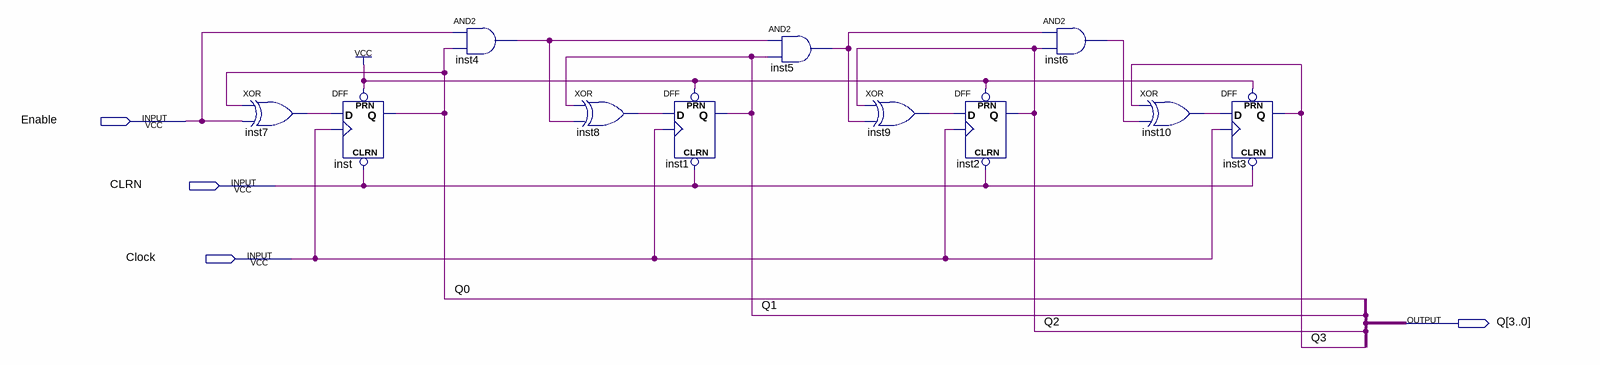
[diagram p0: schematic sheet]
// Quartus schematic lab10step2a.bdf as structural Verilog: 11 symbols, 4 pins
module lab10step2a (
  input  Enable,
  input  CLRN,
  input  Clock,
  output [3:0] Q
);

  wire inst4_out, inst5_out, inst6_out, inst7_out, inst8_out, inst9_out, inst10_out;

  xor inst7 (inst7_out, Q[0], Enable);
  DFF inst (.CLRN(CLRN), .CLK(Clock), .D(inst7_out), .PRN(1'b1), .Q(Q[0]));
  and inst4 (inst4_out, Enable, Q[0]);
  xor inst8 (inst8_out, Q[1], inst4_out);
  DFF inst1 (.CLRN(CLRN), .CLK(Clock), .D(inst8_out), .PRN(1'b1), .Q(Q[1]));
  and inst5 (inst5_out, inst4_out, Q[1]);
  xor inst9 (inst9_out, Q[2], inst5_out);
  DFF inst2 (.CLRN(CLRN), .CLK(Clock), .D(inst9_out), .PRN(1'b1), .Q(Q[2]));
  and inst6 (inst6_out, inst5_out, Q[2]);
  xor inst10 (inst10_out, Q[3], inst6_out);
  DFF inst3 (.CLRN(CLRN), .CLK(Clock), .D(inst10_out), .PRN(1'b1), .Q(Q[3]));
endmodule
